# EAGLE schematic neuzplaits (EAGLE 9.6.2)
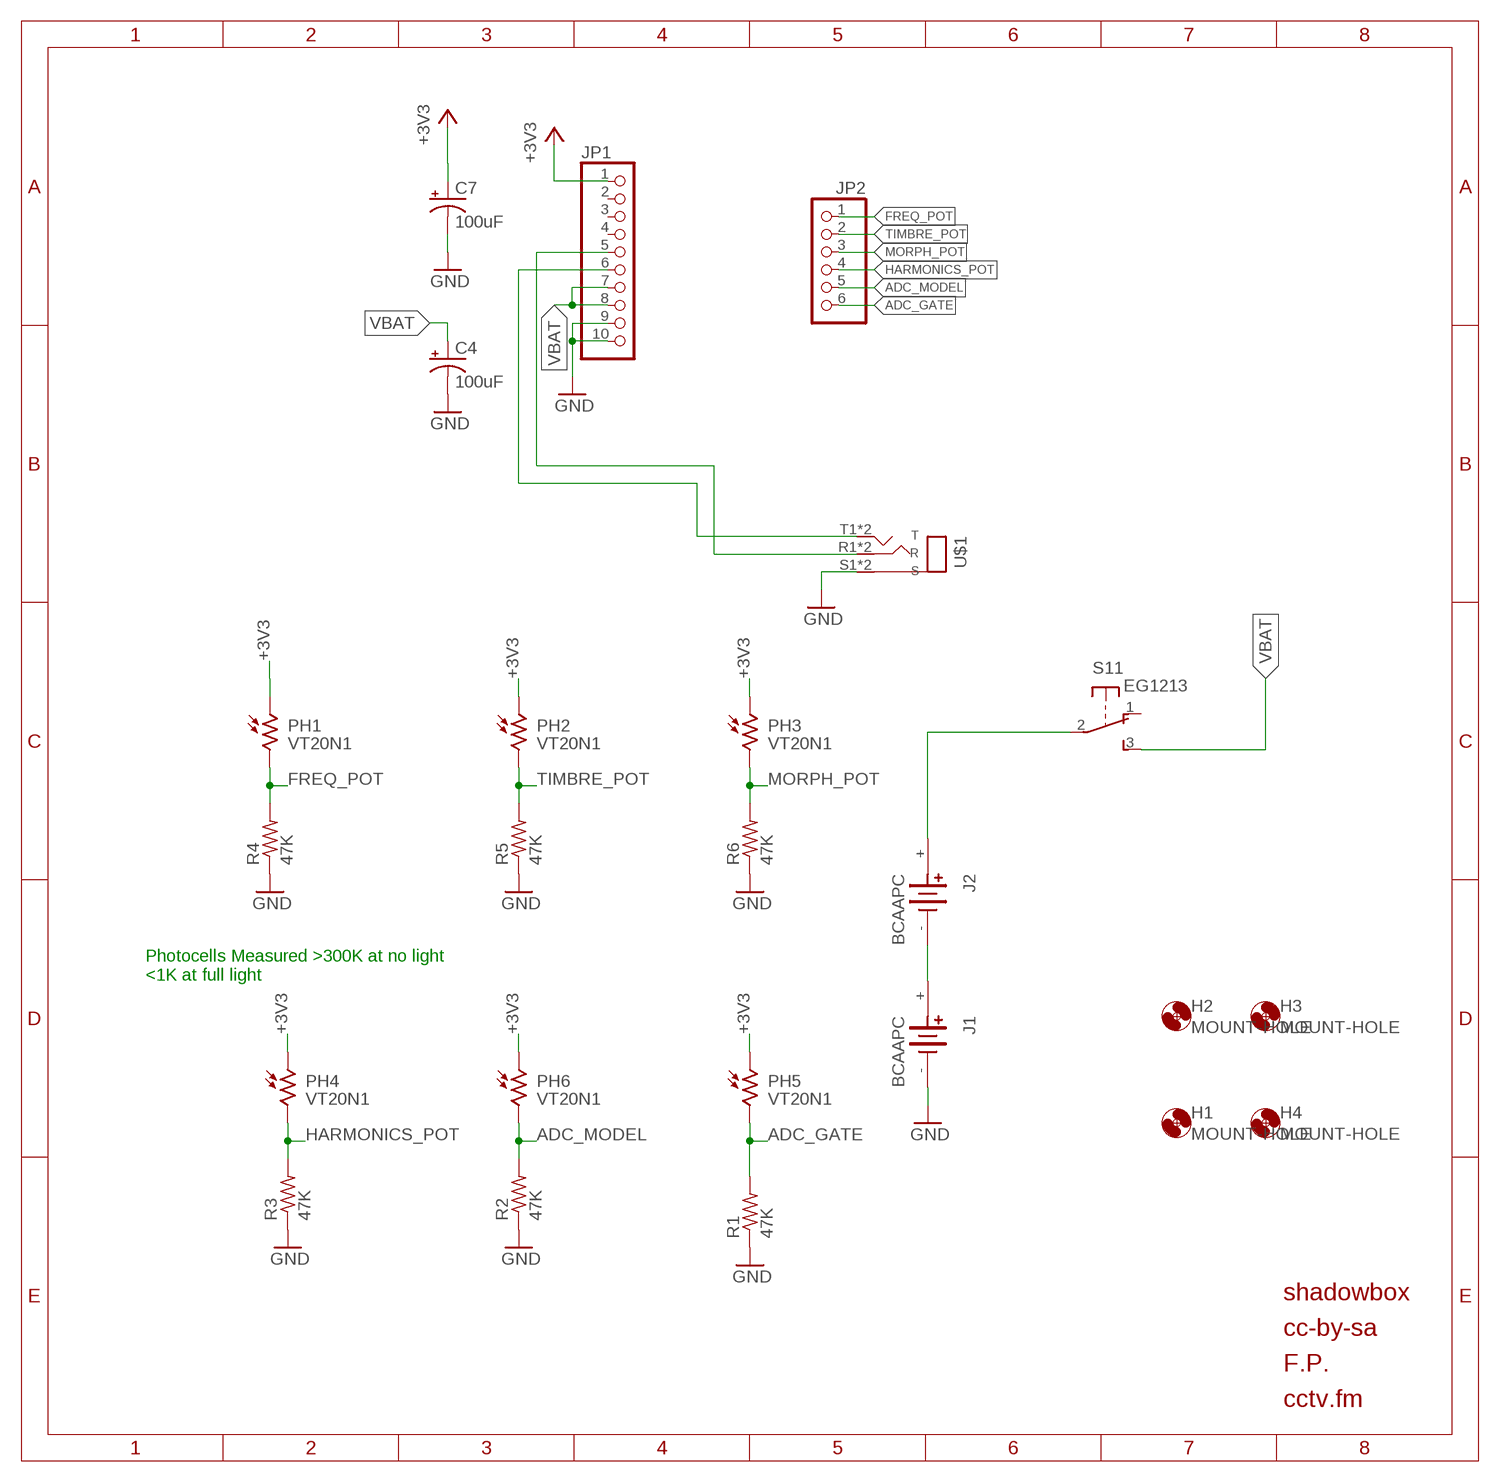
[diagram p0: schematic, sheet 1]

## Parts
C4  100uF  CPOL-USE2.5-6  [E2,5-6]
C7  100uF  CPOL-USE2.5-6  [E2,5-6]
H1  MOUNT-HOLE  MOUNT-HOLE3.0TINY  [3,0TINY]
H2  MOUNT-HOLE  MOUNT-HOLE3.0TINY  [3,0TINY]
H3  MOUNT-HOLE  MOUNT-HOLE3.0TINY  [3,0TINY]
H4  MOUNT-HOLE  MOUNT-HOLE3.0TINY  [3,0TINY]
J1  BCAAPC  [MPD_BCAAPC]
J2  BCAAPC  [MPD_BCAAPC]
JP1  PINHD-1X10  [1X10]
JP2  PINHD-1X6  [1X06]
PH1  VT20N1  [TO46-VT200]
PH2  VT20N1  [TO46-VT200]
PH3  VT20N1  [TO46-VT200]
PH4  VT20N1  [TO46-VT200]
PH5  VT20N1  [TO46-VT200]
PH6  VT20N1  [TO46-VT200]
R1  47K  RES-7.5-EASYSOLDER  [0204/7]
R2  47K  RES-7.5-EASYSOLDER  [0204/7]
R3  47K  RES-7.5-EASYSOLDER  [0204/7]
R4  47K  RES-7.5-EASYSOLDER  [0204/7]
R5  47K  RES-7.5-EASYSOLDER  [0204/7]
R6  47K  RES-7.5-EASYSOLDER  [0204/7]
S1  EG1213  [EG1213]
U$1  PJ-3136-B  [PJ-3136-B]

## Nets
+3V3: C7.+ JP1.1 PH1.1 PH2.1 PH3.1 PH4.1 PH5.1 PH6.1
ADC_GATE: JP2.6 PH5.2 R1.2
ADC_MODEL: JP2.5 PH6.2 R2.2
FREQ_POT: JP2.1 PH1.2 R4.2
GND: C4.- C7.- J1.- JP1.9 JP1.10 R1.1 R2.1 R3.1 R4.1 R5.1 R6.1 U$1.S1(S) U$1.S2(S)
HARMONICS_POT: JP2.4 PH4.2 R3.2
MORPH_POT: JP2.3 PH3.2 R6.2
N$1: J2.+ S1.2(1:P)
N$2: JP1.6 U$1.T1(T) U$1.T2(T)
N$3: JP1.5 U$1.R1(R) U$1.R2(R)
N$4: J1.+ J2.-
TIMBRE_POT: JP2.2 PH2.2 R5.2
VBAT: C4.+ JP1.7 JP1.8 S1.3(1:S)
Unconnected: JP1.2 JP1.3 JP1.4 S1.1(1:O) S1.MT1(MT) S1.MT2(MT)

## Notes on the sheet
- Photocells Measured >300K at no light
  <1K at full light
- shadowbox
- cc-by-sa
- F.P.
- cctv.fm

## Library data of the parts
C4 C7 = rcl:CPOL-US: POLARIZED CAPACITOR, American symbol; SPICEPREFIX: C
H1-H4 = og-holes:MOUNT-HOLE: MOUNTING HOLE with drill center marker
J1 J2 = BatteryHolder:BCAAPC: Holder Battery Aa Plastic Pc Mnt; AVAILABILITY: Unavailable; DESCRIPTION: BATTERY HOLDER AA PC PIN; MF: MPD; MP: BCAAPC; PACKAGE: None; PRICE: None
JP1 = pinhead:PINHD-1X10: PIN HEADER
JP2 = pinhead:PINHD-1X6: PIN HEADER
PH1-PH6 = photo-elements:VT2*: Photoconductive Cell VT200 Series Source: http://optoelectronics.perkinelmer.com/content/Datasheets/DTS_vt200seriesdatasheet.pdf
R1-R6 = ptrz:RES-7.5-EASYSOLDER
S1 = adafruit:EG1213: E-Switch right-angle slide SPDT Part #EG1213 http://www.ladyada.net/library/eagle
U$1 = ptrz:PJ-3136-B

## Net classes
0 default: width 0.762 mm, drill 0.635 mm, clearance 0.635 mm